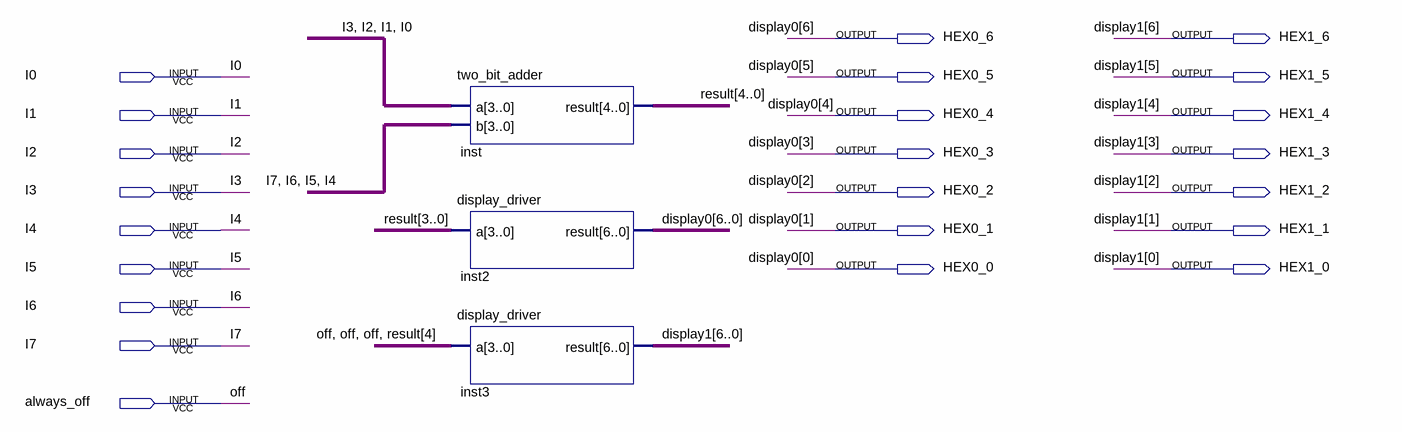
[diagram p0: schematic sheet]
// Quartus schematic display_sum.bdf as structural Verilog: 3 symbols, 23 pins
module display_sum (
  input  I0,
  input  I1,
  input  I2,
  input  I3,
  input  I4,
  input  I5,
  input  I6,
  input  I7,
  input  always_off,
  output HEX0_6,
  output HEX1_6,
  output HEX0_5,
  output HEX1_5,
  output HEX0_4,
  output HEX1_4,
  output HEX0_3,
  output HEX1_3,
  output HEX0_2,
  output HEX1_2,
  output HEX0_1,
  output HEX1_1,
  output HEX0_0,
  output HEX1_0
);

  wire [4:0] result;

  two_bit_adder inst (.a({I3, I2, I1, I0}), .b({I7, I6, I5, I4}), .result(result));
  display_driver inst2 (.a(result[3:0]), .result({HEX0_6, HEX0_5, HEX0_4, HEX0_3, HEX0_2, HEX0_1, HEX0_0}));
  display_driver inst3 (
    .a({{3{always_off}}, result[4]}), .result({HEX1_6, HEX1_5, HEX1_4, HEX1_3, HEX1_2, HEX1_1, HEX1_0}));

  // Other names for the same wires on the sheet: display0[6:0] = {HEX0_6, HEX0_5, HEX0_4, HEX0_3, HEX0_2, HEX0_1, HEX0_0};
  //   display1[6:0] = {HEX1_6, HEX1_5, HEX1_4, HEX1_3, HEX1_2, HEX1_1, HEX1_0}; off = always_off
endmodule
